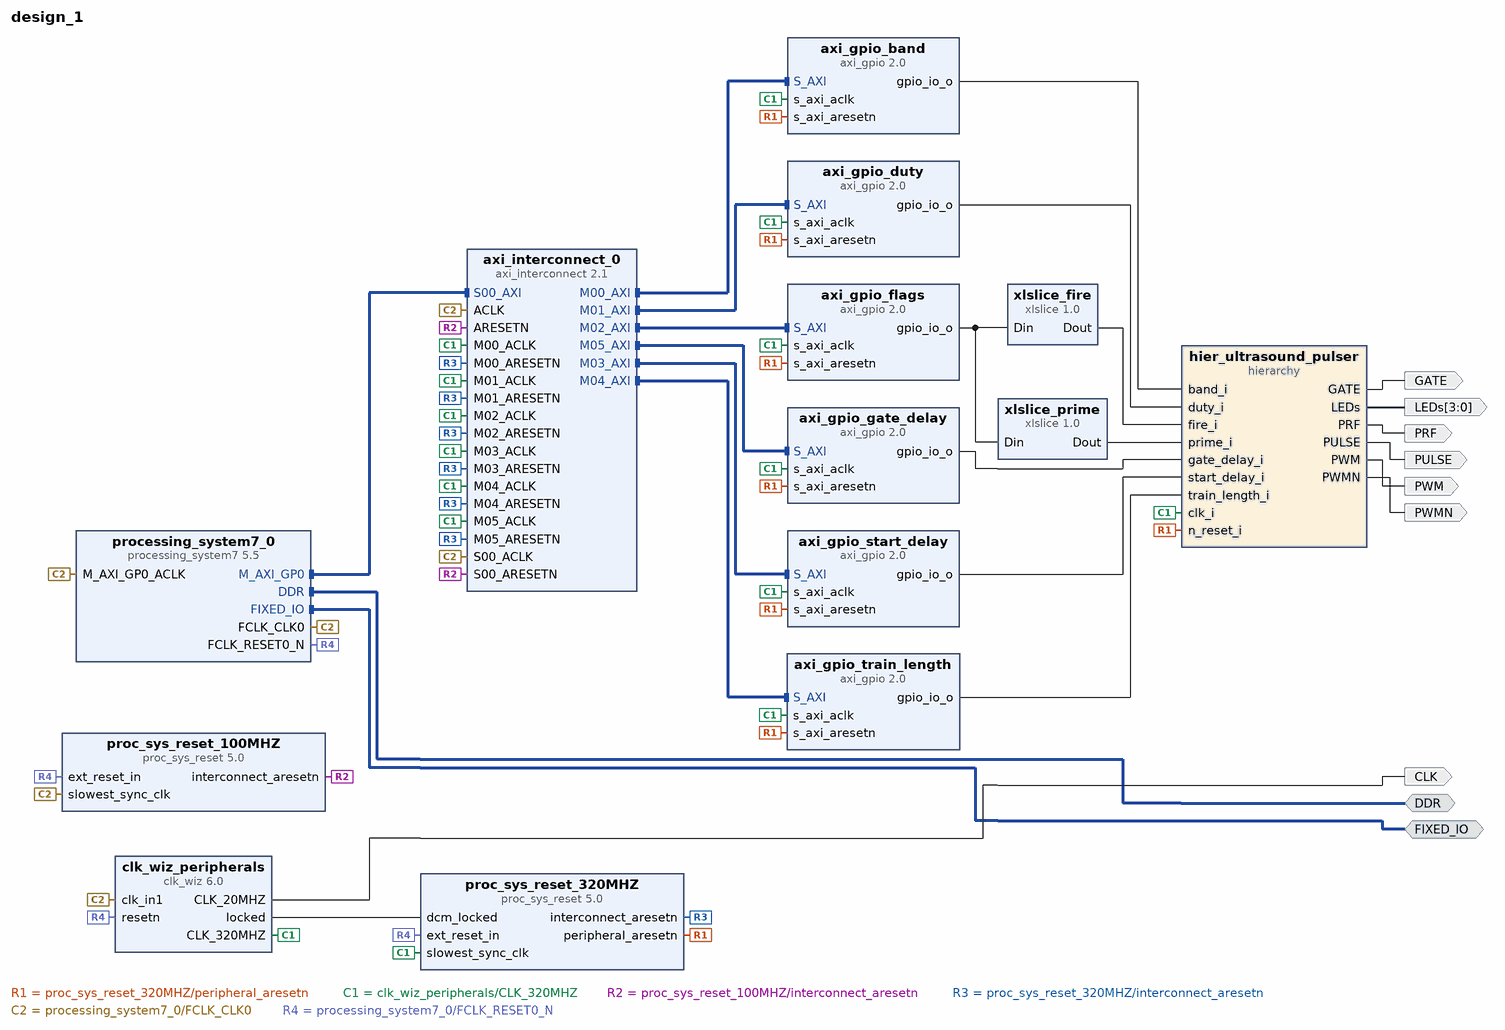
[diagram p0: block diagram of the top level]
# Vivado block design design_1, xc7z020clg400-1, Vivado 2022.2.2
create_bd_design design_1

create_bd_intf_port -mode Master -vlnv xilinx.com:interface:ddrx_rtl:1.0 DDR
create_bd_intf_port -mode Master -vlnv xilinx.com:display_processing_system7:fixedio_rtl:1.0 FIXED_IO
create_bd_port -dir O PWM
create_bd_port -dir O PWMN
create_bd_port -dir O PULSE
create_bd_port -dir O PRF
create_bd_port -dir O GATE
create_bd_port -dir O -from 3 -to 0 LEDs
create_bd_port -dir O -type clk CLK

create_bd_cell -type ip -vlnv xilinx.com:ip:xlslice:1.0 xlslice_fire
set_property -dict {CONFIG.DIN_FROM 0 CONFIG.DIN_TO 0 CONFIG.DOUT_WIDTH 1} [get_bd_cells xlslice_fire]
create_bd_cell -type ip -vlnv xilinx.com:ip:xlslice:1.0 xlslice_prime
set_property -dict {CONFIG.DIN_FROM 1 CONFIG.DIN_TO 1 CONFIG.DOUT_WIDTH 1} [get_bd_cells xlslice_prime]
create_bd_cell -type hier hier_ultrasound_pulser
create_bd_cell -type ip -vlnv xilinx.com:ip:axi_gpio:2.0 axi_gpio_band
set_property -dict [list \
  CONFIG.C_ALL_OUTPUTS 1 \
  CONFIG.C_GPIO_WIDTH 4 \
  CONFIG.C_IS_DUAL 0 \
  CONFIG.GPIO_BOARD_INTERFACE Custom \
  CONFIG.USE_BOARD_FLOW true \
] [get_bd_cells axi_gpio_band]
create_bd_cell -type ip -vlnv xilinx.com:ip:axi_gpio:2.0 axi_gpio_duty
set_property -dict [list \
  CONFIG.C_ALL_OUTPUTS 1 \
  CONFIG.C_DOUT_DEFAULT 0x0000001F \
  CONFIG.C_GPIO_WIDTH 6 \
  CONFIG.GPIO_BOARD_INTERFACE Custom \
  CONFIG.USE_BOARD_FLOW true \
] [get_bd_cells axi_gpio_duty]
create_bd_cell -type ip -vlnv xilinx.com:ip:axi_gpio:2.0 axi_gpio_flags
set_property -dict [list \
  CONFIG.C_ALL_OUTPUTS 1 \
  CONFIG.C_DOUT_DEFAULT 0x00000000 \
  CONFIG.C_GPIO_WIDTH 32 \
  CONFIG.GPIO_BOARD_INTERFACE Custom \
  CONFIG.USE_BOARD_FLOW true \
] [get_bd_cells axi_gpio_flags]
create_bd_cell -type ip -vlnv xilinx.com:ip:axi_gpio:2.0 axi_gpio_start_delay
set_property -dict [list \
  CONFIG.C_ALL_OUTPUTS 1 \
  CONFIG.C_DOUT_DEFAULT 0x00000014 \
  CONFIG.C_GPIO_WIDTH 16 \
  CONFIG.C_IS_DUAL 0 \
  CONFIG.GPIO_BOARD_INTERFACE Custom \
  CONFIG.USE_BOARD_FLOW true \
] [get_bd_cells axi_gpio_start_delay]
create_bd_cell -type ip -vlnv xilinx.com:ip:axi_gpio:2.0 axi_gpio_train_length
set_property -dict [list \
  CONFIG.C_ALL_OUTPUTS 1 \
  CONFIG.C_DOUT_DEFAULT 0x000FFFFF \
  CONFIG.C_GPIO_WIDTH 16 \
  CONFIG.C_IS_DUAL 0 \
  CONFIG.GPIO_BOARD_INTERFACE Custom \
  CONFIG.USE_BOARD_FLOW true \
] [get_bd_cells axi_gpio_train_length]
create_bd_cell -type ip -vlnv xilinx.com:ip:axi_gpio:2.0 axi_gpio_gate_delay
set_property -dict [list \
  CONFIG.C_ALL_OUTPUTS 1 \
  CONFIG.C_DOUT_DEFAULT 0x00000014 \
  CONFIG.C_GPIO_WIDTH 16 \
  CONFIG.C_IS_DUAL 0 \
  CONFIG.GPIO_BOARD_INTERFACE Custom \
  CONFIG.USE_BOARD_FLOW true \
] [get_bd_cells axi_gpio_gate_delay]
create_bd_cell -type ip -vlnv xilinx.com:ip:axi_interconnect:2.1 axi_interconnect_0
set_property -dict {CONFIG.NUM_MI 6} [get_bd_cells axi_interconnect_0]
create_bd_cell -type ip -vlnv xilinx.com:ip:clk_wiz:6.0 clk_wiz_peripherals
set_property -dict [list \
  CONFIG.CLKOUT1_JITTER 105.327 \
  CONFIG.CLKOUT1_PHASE_ERROR 98.575 \
  CONFIG.CLKOUT1_REQUESTED_OUT_FREQ 320 \
  CONFIG.CLKOUT2_JITTER 183.243 \
  CONFIG.CLKOUT2_PHASE_ERROR 98.575 \
  CONFIG.CLKOUT2_REQUESTED_OUT_FREQ 20 \
  CONFIG.CLKOUT2_USED true \
  CONFIG.CLK_OUT1_PORT CLK_320MHZ \
  CONFIG.CLK_OUT2_PORT CLK_20MHZ \
  CONFIG.MMCM_CLKFBOUT_MULT_F 10.000 \
  CONFIG.MMCM_CLKOUT0_DIVIDE_F 3.125 \
  CONFIG.MMCM_CLKOUT1_DIVIDE 50 \
  CONFIG.NUM_OUT_CLKS 2 \
  CONFIG.RESET_PORT resetn \
  CONFIG.RESET_TYPE ACTIVE_LOW \
  CONFIG.USE_LOCKED true \
] [get_bd_cells clk_wiz_peripherals]
create_bd_cell -type ip -vlnv xilinx.com:ip:proc_sys_reset:5.0 proc_sys_reset_100MHZ
create_bd_cell -type ip -vlnv xilinx.com:ip:proc_sys_reset:5.0 proc_sys_reset_320MHZ
create_bd_cell -type ip -vlnv xilinx.com:ip:processing_system7:5.5 processing_system7_0
set_property -dict [list \
  CONFIG.PCW_APU_PERIPHERAL_FREQMHZ 650 \
  CONFIG.PCW_CRYSTAL_PERIPHERAL_FREQMHZ 50 \
  CONFIG.PCW_ENET0_ENET0_IO {MIO 16 .. 27} \
  CONFIG.PCW_ENET0_GRP_MDIO_ENABLE 1 \
  CONFIG.PCW_ENET0_GRP_MDIO_IO {MIO 52 .. 53} \
  CONFIG.PCW_ENET0_PERIPHERAL_ENABLE 1 \
  CONFIG.PCW_ENET0_RESET_ENABLE 1 \
  CONFIG.PCW_ENET0_RESET_IO {MIO 9} \
  CONFIG.PCW_ENET_RESET_ENABLE 1 \
  CONFIG.PCW_ENET_RESET_SELECT {Share reset pin} \
  CONFIG.PCW_FPGA0_PERIPHERAL_FREQMHZ 100 \
  CONFIG.PCW_FPGA1_PERIPHERAL_FREQMHZ 50 \
  CONFIG.PCW_GPIO_MIO_GPIO_ENABLE 1 \
  CONFIG.PCW_GPIO_MIO_GPIO_IO MIO \
  CONFIG.PCW_I2C_RESET_ENABLE 1 \
  CONFIG.PCW_M_AXI_GP0_FREQMHZ 10 \
  CONFIG.PCW_PERIPHERAL_BOARD_PRESET part0 \
  CONFIG.PCW_PRESET_BANK1_VOLTAGE {LVCMOS 1.8V} \
  CONFIG.PCW_QSPI_GRP_FBCLK_ENABLE 1 \
  CONFIG.PCW_QSPI_GRP_FBCLK_IO {MIO 8} \
  CONFIG.PCW_QSPI_GRP_SINGLE_SS_ENABLE 1 \
  CONFIG.PCW_QSPI_GRP_SINGLE_SS_IO {MIO 1 .. 6} \
  CONFIG.PCW_QSPI_PERIPHERAL_ENABLE 1 \
  CONFIG.PCW_QSPI_QSPI_IO {MIO 1 .. 6} \
  CONFIG.PCW_SD0_GRP_CD_ENABLE 1 \
  CONFIG.PCW_SD0_GRP_CD_IO {MIO 47} \
  CONFIG.PCW_SD0_GRP_WP_ENABLE 0 \
  CONFIG.PCW_SD0_PERIPHERAL_ENABLE 1 \
  CONFIG.PCW_SD0_SD0_IO {MIO 40 .. 45} \
  CONFIG.PCW_SDIO_PERIPHERAL_FREQMHZ 50 \
  CONFIG.PCW_SINGLE_QSPI_DATA_MODE x4 \
  CONFIG.PCW_UART0_PERIPHERAL_ENABLE 1 \
  CONFIG.PCW_UART0_UART0_IO {MIO 14 .. 15} \
  CONFIG.PCW_UART1_PERIPHERAL_ENABLE 0 \
  CONFIG.PCW_UART_PERIPHERAL_FREQMHZ 100 \
  CONFIG.PCW_UIPARAM_DDR_BUS_WIDTH {16 Bit} \
  CONFIG.PCW_UIPARAM_DDR_FREQ_MHZ 525 \
  CONFIG.PCW_UIPARAM_DDR_PARTNO {MT41J256M16 RE-125} \
  CONFIG.PCW_USB0_PERIPHERAL_ENABLE 1 \
  CONFIG.PCW_USB0_RESET_ENABLE 1 \
  CONFIG.PCW_USB0_RESET_IO {MIO 46} \
  CONFIG.PCW_USB0_USB0_IO {MIO 28 .. 39} \
  CONFIG.PCW_USB_RESET_ENABLE 1 \
  CONFIG.PCW_USB_RESET_SELECT {Share reset pin} \
] [get_bd_cells processing_system7_0]
# 497 more settings of processing_system7_0 are not shown: defaults, MIO pin electricals, DDR timing, and values the tool derives

# ---- hierarchy /hier_ultrasound_pulser ----
current_bd_instance /hier_ultrasound_pulser
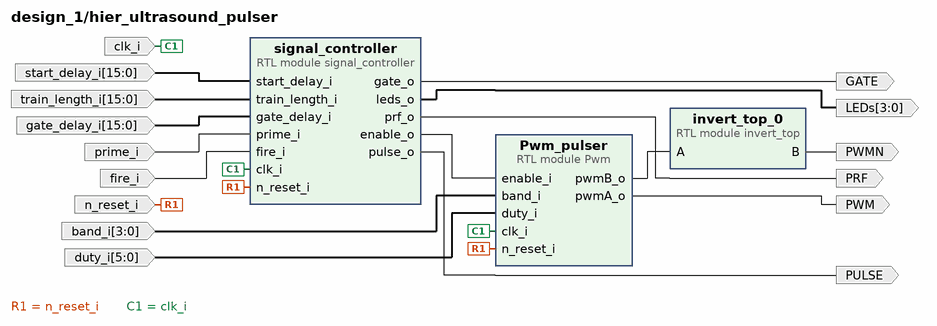
[diagram p1: block diagram inside /hier_ultrasound_pulser]
create_bd_pin -dir I n_reset_i
create_bd_pin -dir I clk_i
create_bd_pin -dir I -from 5 -to 0 duty_i
create_bd_pin -dir I -from 3 -to 0 band_i
create_bd_pin -dir O PWM
create_bd_pin -dir O PWMN
create_bd_pin -dir I -from 15 -to 0 start_delay_i
create_bd_pin -dir I -from 15 -to 0 train_length_i
create_bd_pin -dir I prime_i
create_bd_pin -dir I fire_i
create_bd_pin -dir O PRF
create_bd_pin -dir O PULSE
create_bd_pin -dir O GATE
create_bd_pin -dir O -from 3 -to 0 LEDs
create_bd_pin -dir I -from 15 -to 0 gate_delay_i

create_bd_cell -type module -reference signal_controller signal_controller
set_property -dict [list \
  CONFIG.counter_resolution 16 \
  CONFIG.gate_delay_resolution 16 \
  CONFIG.start_delay_resolution 16 \
  CONFIG.train_length 16 \
] [get_bd_cells signal_controller]
create_bd_cell -type module -reference Pwm Pwm_pulser
set_property -dict {CONFIG.resolution 6} [get_bd_cells Pwm_pulser]
create_bd_cell -type module -reference invert_top invert_top_0

# ---- connections ----

current_bd_instance /hier_ultrasound_pulser
connect_bd_net -net M00_ARESETN_1 [get_bd_pins n_reset_i] [get_bd_pins signal_controller/n_reset_i] [get_bd_pins Pwm_pulser/n_reset_i]
connect_bd_net -net Pwm_0_pwmA_o [get_bd_pins Pwm_pulser/pwmA_o] [get_bd_pins PWM]
connect_bd_net [get_bd_pins Pwm_pulser/pwmB_o] [get_bd_pins invert_top_0/A]
connect_bd_net -net axi_gpio_band_gpio_io_o [get_bd_pins band_i] [get_bd_pins Pwm_pulser/band_i]
connect_bd_net -net axi_gpio_duty_gpio_io_o [get_bd_pins duty_i] [get_bd_pins Pwm_pulser/duty_i]
connect_bd_net -net axi_gpio_start_delay_gpio_io_o [get_bd_pins start_delay_i] [get_bd_pins signal_controller/start_delay_i]
connect_bd_net -net axi_gpio_train_length_gpio_io_o [get_bd_pins train_length_i] [get_bd_pins signal_controller/train_length_i]
connect_bd_net -net clk_wiz_320MHZ_CLK_320MHZ [get_bd_pins clk_i] [get_bd_pins signal_controller/clk_i] [get_bd_pins Pwm_pulser/clk_i]
connect_bd_net [get_bd_pins gate_delay_i] [get_bd_pins signal_controller/gate_delay_i]
connect_bd_net [get_bd_pins invert_top_0/B] [get_bd_pins PWMN]
connect_bd_net -net signal_controller_0_enable_o [get_bd_pins signal_controller/enable_o] [get_bd_pins Pwm_pulser/enable_i]
connect_bd_net -net signal_controller_0_gate_o [get_bd_pins signal_controller/gate_o] [get_bd_pins GATE]
connect_bd_net -net signal_controller_0_leds_o [get_bd_pins signal_controller/leds_o] [get_bd_pins LEDs]
connect_bd_net -net signal_controller_0_prf_o [get_bd_pins signal_controller/prf_o] [get_bd_pins PRF]
connect_bd_net -net signal_controller_0_pulse_o [get_bd_pins signal_controller/pulse_o] [get_bd_pins PULSE]
connect_bd_net -net xlslice_prime_Dout [get_bd_pins prime_i] [get_bd_pins signal_controller/prime_i]
connect_bd_net -net xlslice_start_Dout [get_bd_pins fire_i] [get_bd_pins signal_controller/fire_i]

current_bd_instance /
connect_bd_intf_net [get_bd_intf_pins axi_gpio_band/S_AXI] [get_bd_intf_pins axi_interconnect_0/M00_AXI]
connect_bd_intf_net [get_bd_intf_pins axi_gpio_duty/S_AXI] [get_bd_intf_pins axi_interconnect_0/M01_AXI]
connect_bd_intf_net [get_bd_intf_pins axi_gpio_flags/S_AXI] [get_bd_intf_pins axi_interconnect_0/M02_AXI]
connect_bd_intf_net [get_bd_intf_pins axi_gpio_start_delay/S_AXI] [get_bd_intf_pins axi_interconnect_0/M03_AXI]
connect_bd_intf_net [get_bd_intf_pins axi_gpio_train_length/S_AXI] [get_bd_intf_pins axi_interconnect_0/M04_AXI]
connect_bd_intf_net [get_bd_intf_pins axi_gpio_gate_delay/S_AXI] [get_bd_intf_pins axi_interconnect_0/M05_AXI]
connect_bd_intf_net [get_bd_intf_ports DDR] [get_bd_intf_pins processing_system7_0/DDR]
connect_bd_intf_net [get_bd_intf_ports FIXED_IO] [get_bd_intf_pins processing_system7_0/FIXED_IO]
connect_bd_intf_net [get_bd_intf_pins processing_system7_0/M_AXI_GP0] [get_bd_intf_pins axi_interconnect_0/S00_AXI]
connect_bd_net -net M00_ARESETN_1 [get_bd_pins proc_sys_reset_320MHZ/peripheral_aresetn] \
  [get_bd_pins hier_ultrasound_pulser/n_reset_i] [get_bd_pins axi_gpio_band/s_axi_aresetn] \
  [get_bd_pins axi_gpio_duty/s_axi_aresetn] [get_bd_pins axi_gpio_flags/s_axi_aresetn] \
  [get_bd_pins axi_gpio_start_delay/s_axi_aresetn] [get_bd_pins axi_gpio_train_length/s_axi_aresetn] \
  [get_bd_pins axi_gpio_gate_delay/s_axi_aresetn]
connect_bd_net -net Pwm_0_pwmA_o [get_bd_pins hier_ultrasound_pulser/PWM] [get_bd_ports PWM]
connect_bd_net -net Pwm_0_pwmB_o [get_bd_pins hier_ultrasound_pulser/PWMN] [get_bd_ports PWMN]
connect_bd_net [get_bd_pins axi_gpio_band/gpio_io_o] [get_bd_pins hier_ultrasound_pulser/band_i]
connect_bd_net [get_bd_pins axi_gpio_duty/gpio_io_o] [get_bd_pins hier_ultrasound_pulser/duty_i]
connect_bd_net [get_bd_pins axi_gpio_flags/gpio_io_o] [get_bd_pins xlslice_fire/Din] [get_bd_pins xlslice_prime/Din]
connect_bd_net [get_bd_pins axi_gpio_start_delay/gpio_io_o] [get_bd_pins hier_ultrasound_pulser/start_delay_i]
connect_bd_net [get_bd_pins axi_gpio_train_length/gpio_io_o] [get_bd_pins hier_ultrasound_pulser/train_length_i]
connect_bd_net -net clk_wiz_320MHZ_CLK_320MHZ [get_bd_pins clk_wiz_peripherals/CLK_320MHZ] \
  [get_bd_pins hier_ultrasound_pulser/clk_i] [get_bd_pins axi_gpio_band/s_axi_aclk] [get_bd_pins axi_gpio_duty/s_axi_aclk] \
  [get_bd_pins axi_gpio_flags/s_axi_aclk] [get_bd_pins axi_gpio_start_delay/s_axi_aclk] \
  [get_bd_pins axi_gpio_train_length/s_axi_aclk] [get_bd_pins axi_gpio_gate_delay/s_axi_aclk] \
  [get_bd_pins axi_interconnect_0/M00_ACLK] [get_bd_pins axi_interconnect_0/M01_ACLK] \
  [get_bd_pins axi_interconnect_0/M02_ACLK] [get_bd_pins axi_interconnect_0/M03_ACLK] \
  [get_bd_pins axi_interconnect_0/M04_ACLK] [get_bd_pins axi_interconnect_0/M05_ACLK] \
  [get_bd_pins proc_sys_reset_320MHZ/slowest_sync_clk]
connect_bd_net -net clk_wiz_320MHZ_locked [get_bd_pins clk_wiz_peripherals/locked] [get_bd_pins proc_sys_reset_320MHZ/dcm_locked]
connect_bd_net [get_bd_pins clk_wiz_peripherals/CLK_20MHZ] [get_bd_ports CLK]
connect_bd_net -net gate_delay_i_1 [get_bd_pins axi_gpio_gate_delay/gpio_io_o] [get_bd_pins hier_ultrasound_pulser/gate_delay_i]
connect_bd_net -net proc_sys_reset_0_interconnect_aresetn [get_bd_pins proc_sys_reset_100MHZ/interconnect_aresetn] \
  [get_bd_pins axi_interconnect_0/ARESETN] [get_bd_pins axi_interconnect_0/S00_ARESETN]
connect_bd_net -net proc_sys_reset_1_interconnect_aresetn [get_bd_pins proc_sys_reset_320MHZ/interconnect_aresetn] \
  [get_bd_pins axi_interconnect_0/M00_ARESETN] [get_bd_pins axi_interconnect_0/M01_ARESETN] \
  [get_bd_pins axi_interconnect_0/M02_ARESETN] [get_bd_pins axi_interconnect_0/M03_ARESETN] \
  [get_bd_pins axi_interconnect_0/M04_ARESETN] [get_bd_pins axi_interconnect_0/M05_ARESETN]
connect_bd_net [get_bd_pins processing_system7_0/FCLK_CLK0] \
  [get_bd_pins axi_interconnect_0/ACLK] [get_bd_pins axi_interconnect_0/S00_ACLK] [get_bd_pins clk_wiz_peripherals/clk_in1] \
  [get_bd_pins proc_sys_reset_100MHZ/slowest_sync_clk] [get_bd_pins processing_system7_0/M_AXI_GP0_ACLK]
connect_bd_net [get_bd_pins processing_system7_0/FCLK_RESET0_N] \
  [get_bd_pins clk_wiz_peripherals/resetn] [get_bd_pins proc_sys_reset_100MHZ/ext_reset_in] \
  [get_bd_pins proc_sys_reset_320MHZ/ext_reset_in]
connect_bd_net -net signal_controller_0_gate_o [get_bd_pins hier_ultrasound_pulser/GATE] [get_bd_ports GATE]
connect_bd_net -net signal_controller_0_leds_o [get_bd_pins hier_ultrasound_pulser/LEDs] [get_bd_ports LEDs]
connect_bd_net -net signal_controller_0_prf_o [get_bd_pins hier_ultrasound_pulser/PRF] [get_bd_ports PRF]
connect_bd_net -net signal_controller_0_pulse_o [get_bd_pins hier_ultrasound_pulser/PULSE] [get_bd_ports PULSE]
connect_bd_net [get_bd_pins xlslice_prime/Dout] [get_bd_pins hier_ultrasound_pulser/prime_i]
connect_bd_net -net xlslice_start_Dout [get_bd_pins xlslice_fire/Dout] [get_bd_pins hier_ultrasound_pulser/fire_i]

# ---- address map ----
assign_bd_address -offset 0x41200000 -range 64K -target_address_space [get_bd_addr_spaces processing_system7_0/Data] [get_bd_addr_segs axi_gpio_band/S_AXI/Reg]
assign_bd_address -offset 0x41210000 -range 64K -target_address_space [get_bd_addr_spaces processing_system7_0/Data] [get_bd_addr_segs axi_gpio_duty/S_AXI/Reg]
assign_bd_address -offset 0x41220000 -range 64K -target_address_space [get_bd_addr_spaces processing_system7_0/Data] [get_bd_addr_segs axi_gpio_flags/S_AXI/Reg]
assign_bd_address -offset 0x41230000 -range 64K -target_address_space [get_bd_addr_spaces processing_system7_0/Data] [get_bd_addr_segs axi_gpio_gate_delay/S_AXI/Reg]
assign_bd_address -offset 0x41240000 -range 64K -target_address_space [get_bd_addr_spaces processing_system7_0/Data] [get_bd_addr_segs axi_gpio_start_delay/S_AXI/Reg]
assign_bd_address -offset 0x41250000 -range 64K -target_address_space [get_bd_addr_spaces processing_system7_0/Data] [get_bd_addr_segs axi_gpio_train_length/S_AXI/Reg]

validate_bd_design
save_bd_design
